# EAGLE design reference_nrf52840_module (EAGLE 9.3.0)
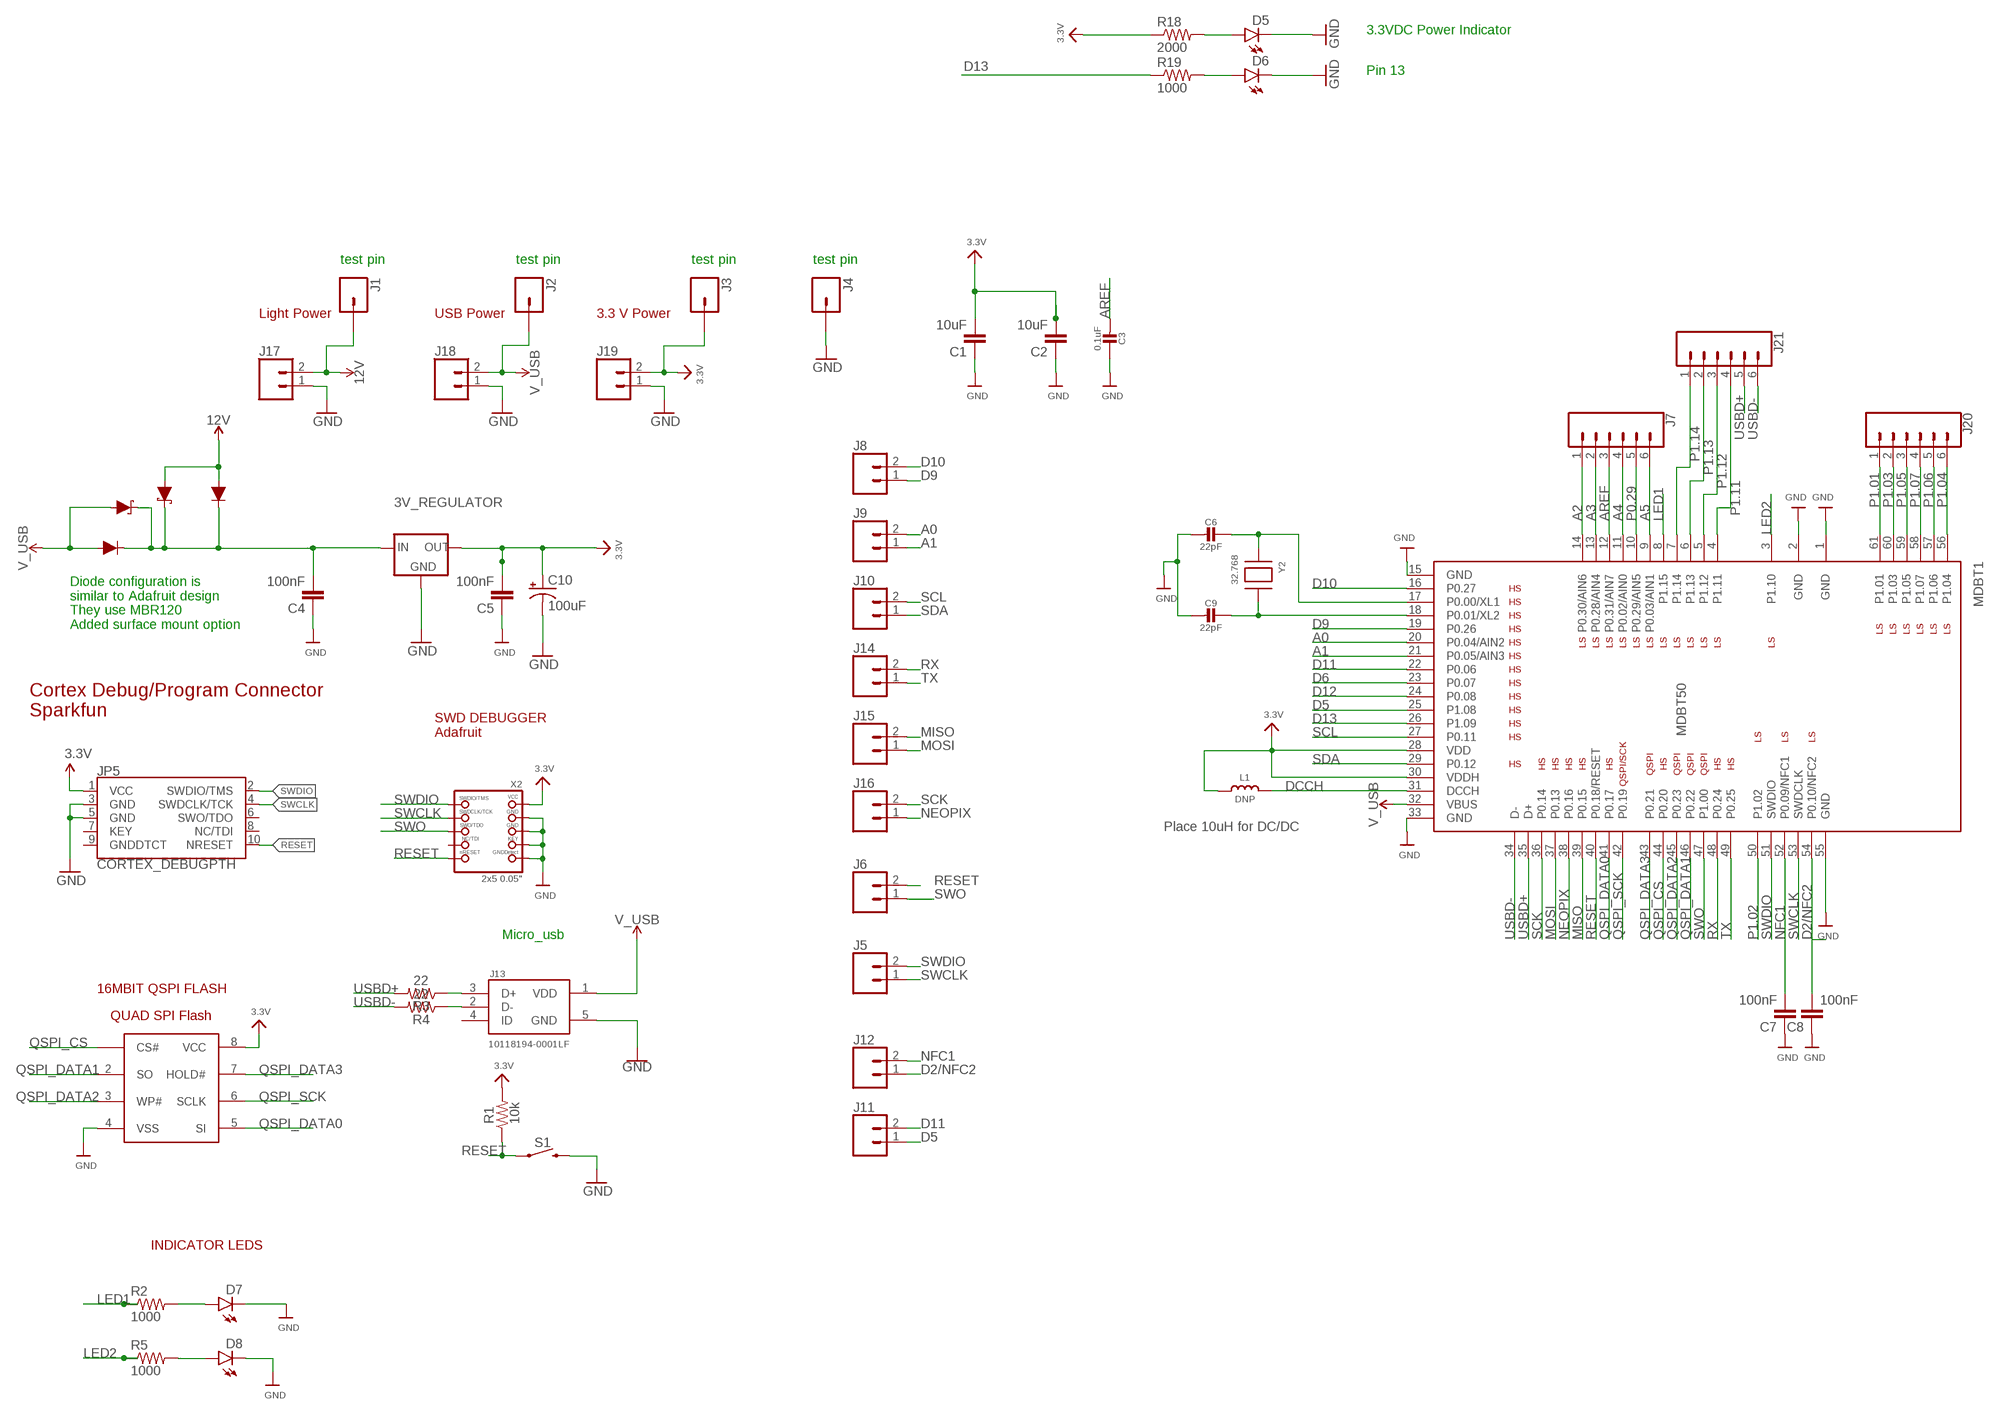
[diagram p0: schematic, sheet 1]

## Parts
3V_REGULATOR  LDL1117_5V_REG  [SOT223]
C1  10uF  10UF-0805-10V-10%  [0805]
C2  10uF  10UF-0805-10V-10%  [0805]
C3  0.1uF  CAP_CERAMIC_0805  [_0805]
C4  100nF  10UF-0805-10V-10%  [0805]
C5  100nF  10UF-0805-10V-10%  [0805]
C6  22pF  CAP_CERAMIC0603_NO  [0603-NO]
C7  100nF  10UF-0805-10V-10%  [0805]
C8  100nF  10UF-0805-10V-10%  [0805]
C9  22pF  CAP_CERAMIC0603_NO  [0603-NO]
C10  100uF  100UF-POLAR-RADIAL-2.5MM-25V-20%  [CPOL-RADIAL-2.5MM-6.5MM]
D1  1A/50V/1.1V  DIODE-PTH  [DIODE-1N4001]
D2  1A/50V/1.1V  DIODE-PTH  [DIODE-1N4001]
D3  3A/40V/500mV  DIODE-SCHOTTKY-B340A  [SMA-DIODE]
D4  3A/40V/500mV  DIODE-SCHOTTKY-B340A  [SMA-DIODE]
D5  LED1206  [LED-1206]
D6  LED1206  [LED-1206]
D7  LED1206  [LED-1206]
D8  LED1206  [LED-1206]
J1  M01PTH  [1X01]
J2  M01PTH  [1X01]
J3  M01PTH  [1X01]
J4  M01PTH  [1X01]
J5  CONN_025MM  [SCREWTERMINAL-5MM-2]
J6  CONN_025MM  [SCREWTERMINAL-5MM-2]
J7  CONN_06NO_SILK_FEMALE_PTH  [1X06_NO_SILK]
J8  CONN_025MM  [SCREWTERMINAL-5MM-2]
J9  CONN_025MM  [SCREWTERMINAL-5MM-2]
J10  CONN_025MM  [SCREWTERMINAL-5MM-2]
J11  CONN_025MM  [SCREWTERMINAL-5MM-2]
J12  CONN_025MM  [SCREWTERMINAL-5MM-2]
J13  10118194-0001LF  [FRAMATOME_10118194-0001LF]
J14  CONN_025MM  [SCREWTERMINAL-5MM-2]
J15  CONN_025MM  [SCREWTERMINAL-5MM-2]
J16  CONN_025MM  [SCREWTERMINAL-5MM-2]
J17  CONN_025MM  [SCREWTERMINAL-5MM-2]
J18  CONN_025MM  [SCREWTERMINAL-5MM-2]
J19  CONN_025MM  [SCREWTERMINAL-5MM-2]
J20  CONN_06NO_SILK_FEMALE_PTH  [1X06_NO_SILK]
J21  CONN_06NO_SILK_FEMALE_PTH  [1X06_NO_SILK]
JP5  CORTEX_DEBUGPTH  [2X5-PTH-1.27MM]
L1  DNP  INDUCTOR_0805MP  [_0805MP]
MDBT1  MDBT50  [MDBT50]
R1  10k  RESISTOR0805  [0805]
R2  1000  RESISTOR0805-RES  [0805]
R3  22  RESISTOR0805  [0805]
R4  22  RESISTOR0805  [0805]
R5  1000  RESISTOR0805-RES  [0805]
R18  2000  RESISTOR0805-RES  [0805]
R19  1000  RESISTOR0805-RES  [0805]
S1  MOMENTARY-SWITCH-SPST-PTH-6.0MM-KIT  [TACTILE_SWITCH_PTH_6.0MM_KIT]
U$4  QUAD_SPI_FLASH  [SO08]
X2  2x5 0.05"  JTAG-CORTEXBOXPOSTS  [2X05_1.27MM_BOX_POSTS]
Y2  32.768  XTAL-3.2X1.5  [XTAL3215]

## Nets
3.3V [power]: 3V_REGULATOR.2(OUT) 3V_REGULATOR.4(OUT) C1.2 C2.2 C5.2 C10.1(+) J3.1 J19.2 JP5.1(VCC) L1.1 MDBT1.28(VDD) MDBT1.30(VDDH) R1.2 R18.1 U$4.8(VCC) X2.1(VCC)
12V: D1.A D3.A J1.1 J17.2
A0: J9.2 MDBT1.20(P0.04/AIN2)
A1: J9.1 MDBT1.21(P0.05/AIN3)
A2: J7.1 MDBT1.14(P0.30/AIN6)
A3: J7.2 MDBT1.13(P0.28/AIN4)
A4: J7.4 MDBT1.11(P0.02/AIN0)
A5: J7.6 MDBT1.9(P0.03/AIN1)
AREF: C3.2 J7.3 MDBT1.12(P0.31/AIN7)
D2/NFC2: C8.2 J12.1 MDBT1.54(P0.10/NFC2)
D5: J11.1 MDBT1.25(P1.08)
D6: MDBT1.23(P0.07)
D9: J8.1 MDBT1.19(P0.26)
D10: J8.2 MDBT1.16(P0.27)
D11: J11.2 MDBT1.22(P0.06)
D12: MDBT1.24(P0.08)
D13: MDBT1.26(P1.09) R19.1
DCCH: L1.2 MDBT1.31(DCCH)
GND: 3V_REGULATOR.1(GND) C1.1 C2.1 C3.1 C4.1 C5.1 C6.2 C7.1 C8.1 C9.2 C10.2(-) D5.C D6.C D7.C D8.C J4.1 J13.5(GND) J17.1 J18.1 J19.1 JP5.3(GND) JP5.5(GND) MDBT1.1(GND) MDBT1.2(GND) MDBT1.15(GND) MDBT1.33(GND) MDBT1.55(GND) S1.3 U$4.4(VSS) X2.3(GND) X2.5(GND) X2.7(KEY) X2.9(GNDDETECT)
LED1: MDBT1.8(P1.15) R2.1
LED2: MDBT1.3(P1.10) R5.1
MISO: J15.2 MDBT1.39(P0.15)
MOSI: J15.1 MDBT1.37(P0.13)
N$1: D7.A R2.2
N$2: J13.3(D+) R3.1
N$3: J13.2(D-) R4.1
N$5: 3V_REGULATOR.3(IN) C4.2 D1.C D2.C D3.C D4.C
N$6: C9.1 MDBT1.18(P0.01/XL2) Y2.P$2
N$7: C6.1 MDBT1.17(P0.00/XL1) Y2.P$1
N$14: D8.A R5.2
N$30: D5.A R18.2
N$31: D6.A R19.2
NEOPIX: J16.1 MDBT1.38(P0.16)
NFC1: C7.2 J12.2 MDBT1.52(P0.09/NFC1)
P0.29: J7.5 MDBT1.10(P0.29/AIN5)
P1.01: J20.1 MDBT1.61(P1.01)
P1.02: MDBT1.50(P1.02)
P1.03: J20.2 MDBT1.60(P1.03)
P1.04: J20.6 MDBT1.56(P1.04)
P1.05: J20.3 MDBT1.59(P1.05)
P1.06: J20.5 MDBT1.57(P1.06)
P1.07: J20.4 MDBT1.58(P1.07)
P1.11: J21.4 MDBT1.4(P1.11)
P1.12: J21.3 MDBT1.5(P1.12)
P1.13: J21.2 MDBT1.6(P1.13)
P1.14: J21.1 MDBT1.7(P1.14)
QSPI_CS: MDBT1.44(P0.20) U$4.1(CS#)
QSPI_DATA0: MDBT1.41(P0.17) U$4.5(SI)
QSPI_DATA1: MDBT1.46(P0.22) U$4.2(SO)
QSPI_DATA2: MDBT1.45(P0.23) U$4.3(WP#)
QSPI_DATA3: MDBT1.43(P0.21) U$4.7(HOLD#)
QSPI_SCK: MDBT1.42(P0.19) U$4.6(SCLK)
RESET: J6.2 JP5.10(NRESET) MDBT1.40(P0.18/RESET) R1.1 S1.1 X2.10(NRESET)
RX: J14.2 MDBT1.48(P0.24)
SCK: J16.2 MDBT1.36(P0.14)
SCL: J10.2 MDBT1.27(P0.11)
SDA: J10.1 MDBT1.29(P0.12)
SWCLK: J5.1 JP5.4(SWDCLK/TCK) MDBT1.53(SWDCLK) X2.4(SWDCLK)
SWDIO: J5.2 JP5.2(SWDIO/TMS) MDBT1.51(SWDIO) X2.2(SWDIO)
SWO: J6.1 MDBT1.47(P1.00) X2.6(SWO)
TX: J14.1 MDBT1.49(P0.25)
USBD+: J21.5 MDBT1.35(D+) R3.2
USBD-: J21.6 MDBT1.34(D-) R4.2
V_USB: D2.A D4.A J2.1 J13.1(VDD) J18.2 MDBT1.32(VBUS)
Unconnected: J13.4(ID) JP5.6(SWO/TDO) JP5.7(KEY) JP5.8(NC/TDI) JP5.9(GNDDTCT) X2.8(TDI)

## Notes on the sheet
- 3.3VDC Power Indicator
- Pin 13
- test pin | test pin | test pin | test pin
- Light Power | USB Power | 3.3 V Power
- Diode configuration is
  similar to Adafruit design
  They use MBR120
  Added surface mount option
- Cortex Debug/Program Connector
  Sparkfun
- SWD DEBUGGER
  Adafruit
- Place 10uH for DC/DC
- Micro_usb
- 16MBIT QSPI FLASH
- INDICATOR LEDS

## Library data of the parts
3V_REGULATOR = th_libraries_2:LDL1117_5V_REG: STMicroelectronics LDL1117S50R https://www.mouser.com/datasheet/2/389/ldl1117-1156241.pdf Mouser#: 511-LDL1117S50R bought 100 for $18 on ~2/3/18 5V, 1.2amp
C1 C2 = SparkFun-Capacitors:10UF: 10.0µF ceramic capacitors A capacitor is a passive two-terminal electrical component used to store electrical energy temporarily in an electric field.; PROD_ID: CAP-11330
C3 C6 C9 = microbuilder:CAP_CERAMIC: Ceramic Capacitors For new designs, use the packages preceded by an '_' character since they are more reliable: The following footprints should be used on most boards: _0402 - Standard footprint for regular board layouts _0603 - Standard footprint for regular board layouts _0805 - Standard footprint for regular board layouts _1206 - Standard footprint for regular board layouts For extremely tight-pitch boards where space is at a premium, the following 'micro-pitch' footprints can be used (smaller pads, no silkscreen outline, etc.): _0402MP - Micro-pitch footprint for very dense/compact boards _0603MP - Micro-pitch footprint for very dense/compact boards _0805MP - Micro-pitch footprint for very dense/compact boards _1206MP - Micro-pitch footprint for very dense/compact boards
C4 C5 C7 C8 = SparkFun-Capacitors:10UF: 10.0µF ceramic capacitors A capacitor is a passive two-terminal electrical component used to store electrical energy temporarily in an electric field.; PROD_ID: CAP-11330; VALUE: 10uF
C10 = SparkFun-Capacitors:100UF-POLAR: 100µF polarized capacitors A capacitor is a passive two-terminal electrical component used to store electrical energy temporarily in an electric field.; PROD_ID: CAP-08439
D1 D2 = SparkFun-DiscreteSemi:DIODE: Diode These are standard reverse protection diodes and small signal diodes. SparkFun Products: SparkFun SparkPunk Sound Kit <https://www.sparkfun.com/products/11177> SparkFun ESP8266 Thing <https://www.sparkfun.com/products/13231>; PROD_ID: DIO-09176
D3 D4 = SparkFun-DiscreteSemi:DIODE-SCHOTTKY: Schottky diode A Schottky diode is a semiconductor diode which has a low forward voltage drop and a very fast switching action.; PROD_ID: DIO-09886
D5-D8 = SparkFun-LED:LED: LEDs Standard schematic elements and footprints for 5mm, 3mm, 1206, and 0603 sized LEDs. 5mm - Spark Fun Electronics SKU : COM-00529 (and others)
J1-J4 = SparkFun-Connectors:M01: Header 1 Standard 1-pin 0.1" header. Use with straight break away headers (SKU : PRT-00116), right angle break away headers (PRT-00553), swiss pins (PRT-00743), machine pins (PRT-00117), and female headers (PRT-00115). SMTSO-256-ET is a "flush mount" nut for a 4-40 screw. The older package used to be too tight, and did not allow it to sit properly thru the drill hit. The latest (0.165DIA) fits nice and snug.
J5 J6 J8-J12 J14-J19 = SparkFun-Connectors:CONN_02: Multi connection point. Often used as Generic Header-pin footprint for 0.1 inch spaced/style header connections On any of the 0.1 inch spaced packages, you can populate with these: Break Away Headers - Straight <https://www.sparkfun.com/products/116> (PRT-00116) Break Away Male Headers - Right Angle <https://www.sparkfun.com/products/553> (PRT-00553) Female Headers <https://www.sparkfun.com/products/115> (PRT-00115) Break Away Headers - Machine Pin <https://www.sparkfun.com/products/117> (PRT-00117) Break Away Female Headers - Swiss Machine Pin <https://www.sparkfun.com/products/743> (PRT-00743) For SCREWTERMINALS and SPRING TERMINALS visit here: Screw Terimnals on SparkFun.com <https://www.sparkfun.com/search/results?term=Screw+Terminals> (5mm/3.5mm/2.54mm spacing) This device is also useful as a general connection point to wire up your design to another part of your project. Our various solder wires solder well into these plated through hole pads. Hook-Up Wire - Assortment (Stranded, 22 AWG) <https://www.sparkfun.com/products/11375> (PRT-11375) Hook-Up Wire - Assortment (Solid Core, 22 AWG) <https://www.sparkfun.com/products/11367> (PRT-11367) View the entire wire category on our website here <https://www.sparkfun.com/categories/141> Special notes: Molex polarized connector foot print use with: PRT-08233 with associated crimp pins and housings. 2.54_SCREWTERM for use with PRT-10571. 3.5mm Screw Terminal footprints for PRT-08084 5mm Screw Terminal footprints for use with PRT-08432; SF_SKU: PRT-08432
J7 J20 J21 = SparkFun-Connectors:CONN_06: Multi connection point. Often used as Generic Header-pin footprint for 0.1 inch spaced/style header connections On any of the 0.1 inch spaced packages, you can populate with these: Break Away Headers - Straight <https://www.sparkfun.com/products/116> (PRT-00116) Break Away Male Headers - Right Angle <https://www.sparkfun.com/products/553> (PRT-00553) Female Headers <https://www.sparkfun.com/products/115> (PRT-00115) Break Away Headers - Machine Pin <https://www.sparkfun.com/products/117> (PRT-00117) Break Away Female Headers - Swiss Machine Pin <https://www.sparkfun.com/products/743> (PRT-00743) Arduino Stackable Header - 6 Pin <https://www.sparkfun.com/products/9280> (PRT-09280) For SCREWTERMINALS and SPRING TERMINALS visit here: Screw Terimnals on SparkFun.com <https://www.sparkfun.com/search/results?term=Screw+Terminals> (5mm/3.5mm/2.54mm spacing) This device is also useful as a general connection point to wire up your design to another part of your project. Our various solder wires solder well into these plated through hole pads. Hook-Up Wire - Assortment (Stranded, 22 AWG) <https://www.sparkfun.com/products/11375> (PRT-11375) Hook-Up Wire - Assortment (Solid Core, 22 AWG) <https://www.sparkfun.com/products/11367> (PRT-11367) View the entire wire category on our website here <https://www.sparkfun.com/categories/141>; PROD_ID: CONN-08437
J13 = 10118194-0001LF:10118194-0001LF: Conn Micro USB Type B RCP 5 POS 0.65mm Solder RA SMD 5 Terminal 1 Port T/R; AVAILABILITY: Unavailable; DESCRIPTION: Micro Usb, 2.0 Type b, Rcpt, Smt; MF: Amphenol ICC; MP: 10118194-0001LF; PACKAGE: None; PRICE: None
JP5 = samd21-temp:CORTEX_DEBUG: Cortex Debug Connector Datasheet <http://infocenter.arm.com/help/topic/com.arm.doc.faqs/attached/13634/cortex_debug_connectors.pdf>
L1 = microbuilder:INDUCTOR: Inductors 0603: 10nH Ceramic Inductor - microwire antenna/RF (Digikey: 712-1434-2-ND) 0805: 560nH Ceramic Inductor - RF (Digikey: 553-1047-1-ND) 270nH Ceramic Inductor - Q = 40@250MHz, +-5%, 1 Ohm DC Resistance (Digikey: 535-10506-2-ND) 1007 (2518 Metric) SMT: 10µH 10% 250mOhm 820mA 1007 Inductor (Digikey: 587-2189-1-ND) 22µH 10% 500mOhm 580mA 1007 Inductor (Digikey: 587-2190-1-ND) 47µH 10% 950mOhm 420mA 1007 Inductor (Digikey: 587-2191-1-ND) 47µH 5% 100mOhm 1A 1008 Inductor (Digikey: 732-1816-1-ND) 5.0x5.0mm (Taiyo Yuden NR5040 Series) 6.8µH 20% 2.3A 64mOhm Inductor (Digikey: 587-2374-2-ND) 5.0x5.0mm (TDK VLC5045 Series) 4.7µH 20% 3.3A 34mOhm Inductor (Digikey: 445-6526-1-ND) 6.8µH 20% 2.7A 46mOhm Inductor (Digikey: 445-6527-1-ND) 6.0x6.0mm (TDK VLC6045 Series) 4.7µH 20% 3.8A 27mOhm Inductor (Digikey: 445-6538-2-ND) 6.8µH 20% 3A 41mOhm Inductor (Digikey: 445-6540-1-ND) 6.2µH 30% 2.2A 45mOhm Inductor (Digikey: SRR5028-6R2YCT-ND) - Not TDK VLC6045 but footprint should match 6.0x6.0mm (TDK SLF6045 Series) 6.8uH 30% 2A 33mOhm Inductor (Digikey: 445-4572-1-ND, Mouser: 810-SLF645T6R8N2R0PF) 6.0x6.0mm (Sumida CDRH5D28 Series) 6.2uH 30% 1.8A 45mOhm Inductor (Digikey: 308-1542-1-ND) Taiyo Yuden NR3015T2R2M - 2.2uH 20% 1.5A (Digikey: 587-1648-2-ND, Mouser: 963-NR3015T2R2M) - Used with TI TPS62172 CoilCraft RFID Transponder Coil - MA5532-AE (For use with AS3935 Lightning Sensor) Taiyo Yuden NRH2412T2R2MNGH - 2.2uH 20% 1AA (Digikey: 587-3443-1-ND) - Used with TI LM3671 Vishay IHLP 1.0uH Molded Inductor - 24mOhm DCR, 5A, +/-20%, -55°C-125°C (Digikey: 541-1319-1-ND)
MDBT1 = microbuilder:MDBT50: Raytac Corporation MDBT50 Bluetooth Low Energy Module based on Noridc nRF52840 Source: Raytac datasheet
R1 R3 R4 = SparkFun-Resistors:RESISTOR: Generic Resistor Package
R2 R5 R18 R19 = SparkFun-Passives:RESISTOR: Resistor Basic schematic elements and footprints for 0603, 1206, and PTH resistors.
S1 = SparkFun-Switches:MOMENTARY-SWITCH-SPST: Momentary Switch (Pushbutton) - SPST Normally-open (NO) SPST momentary switches (buttons, pushbuttons). Variants PTH-12MM - 12mm square, through-hole Momentary Pushbutton Switch - 12mm Square <https://www.sparkfun.com/products/9190> (COM-09190) PTH-6.0MM, PTH-6.0MM-KIT - 6.0mm square, through-hole Mini Pushbutton Switch <https://www.sparkfun.com/products/97> (COM-00097) KIT package intended for soldering kit's - only one side of pads' copper is exposed. PTH-RIGHT-ANGLE-KIT - Right-angle, through-hole Right Angle Tactile Button <https://www.sparkfun.com/products/10791> - Used on SparkFun BigTime Watch Kit <https://www.sparkfun.com/products/11734> SMD-12MM - 12mm square, surface-mount Tactile Button - SMD (12mm) <https://www.sparkfun.com/products/12993> (COM-12993) Used on SparkFun PicoBoard <https://www.sparkfun.com/products/11888> SMD-4.5MM - 4.5mm Square Trackball Switch Used on SparkFun Blackberry Trackballer Breakout <https://www.sparkfun.com/products/13169> SMD-4.6MMX2.8MM - 4.60mm x 2.80mm, surface mount Used on SparkFun SAMD21 Mini Breakout <https://www.sparkfun.com/products/13664> SMD-5.2MM, SMD-5.2-REDUNDANT - 5.2mm square, surface-mount Mini Pushbutton Switch - SMD <https://www.sparkfun.com/products/8720> (COM-08720) Used on Arduino Pro Mini <https://www.sparkfun.com/products/11114> REDUNDANT package connects both switch circuits together SMD-6.0X3.5MM - 6.0 x 3.5mm, surface mount Momentary Reset Switch SMD <https://www.sparkfun.com/products/8229> (COM-08229) SMD-6.2MM-TALL - 6.2mm square, surface mount Tactile Button - SMD (6mm) <https://www.sparkfun.com/products/12992> Used on SparkFun Digital Sandbox <https://www.sparkfun.com/products/12651> SMD-RIGHT-ANGLE - Right-angle, surface mount Used on SparkFun Block for Intel® Edison - Arduino <https://www.sparkfun.com/products/13036>; PROD_ID: SWCH-08441; SF_SKU: COM-00097
U$4 = th_libraries_2:QUAD_SPI_FLASH: https://www.digikey.com/product-detail/en/gigadevice-semiconductor-hk-limited/GD25Q32CSJGR/1970-1032-1-ND/9484782 16 and 32Mbit flash for circuit python
X2 = microbuilder:JTAG-CORTEX: Serial Wire (SW-DP) Connector Standard 0.05" 10-pin connector is for use with the Cortex M and Cortex A SWD (serial wire debugger) interface (SW-DP) Connectors 2x05_1.27MM_SMT - Inexpensive surface-mount header with bare pins, compatible with standard 10-pin SWD cables (4UCON: 16846) 2x05_1.27MM_BOX_NOPOSTS - Polarised surface-mount box (4UCON with caps: 19735, without caps: 15117 2x05_1.27MM_BOX_POSTS - Polarised surface-mount box with mounting holes (4UCON: 20317) Pinout: http://infocenter.arm.com/help/topic/com.arm.doc.faqs/attached/13634/cortex_debug_connectors.pdf http://www.keil.com/peripherals/coresight/connectors.asp
Y2 = adafruit2:XTAL: Low cost SMT crystals, no capacitors included http://www.ladyada.net/library/eagle

## Net classes
1 power: width 0.254 mm

## Board
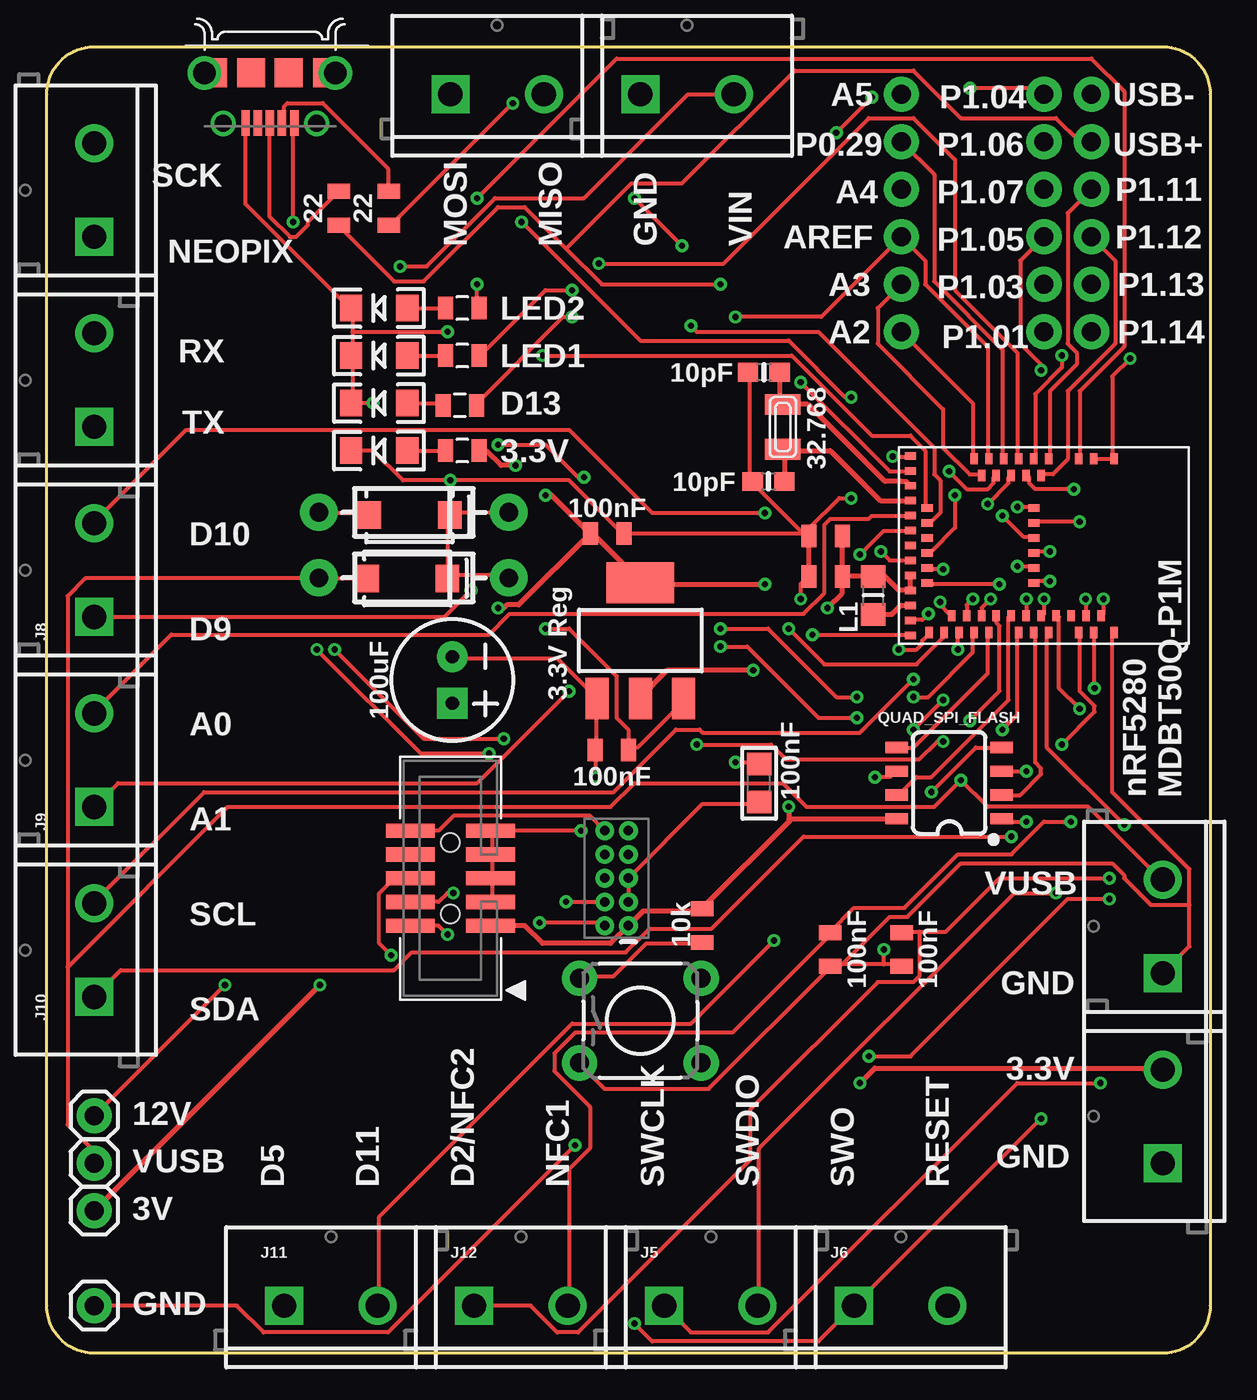
[diagram p1: board, top side]
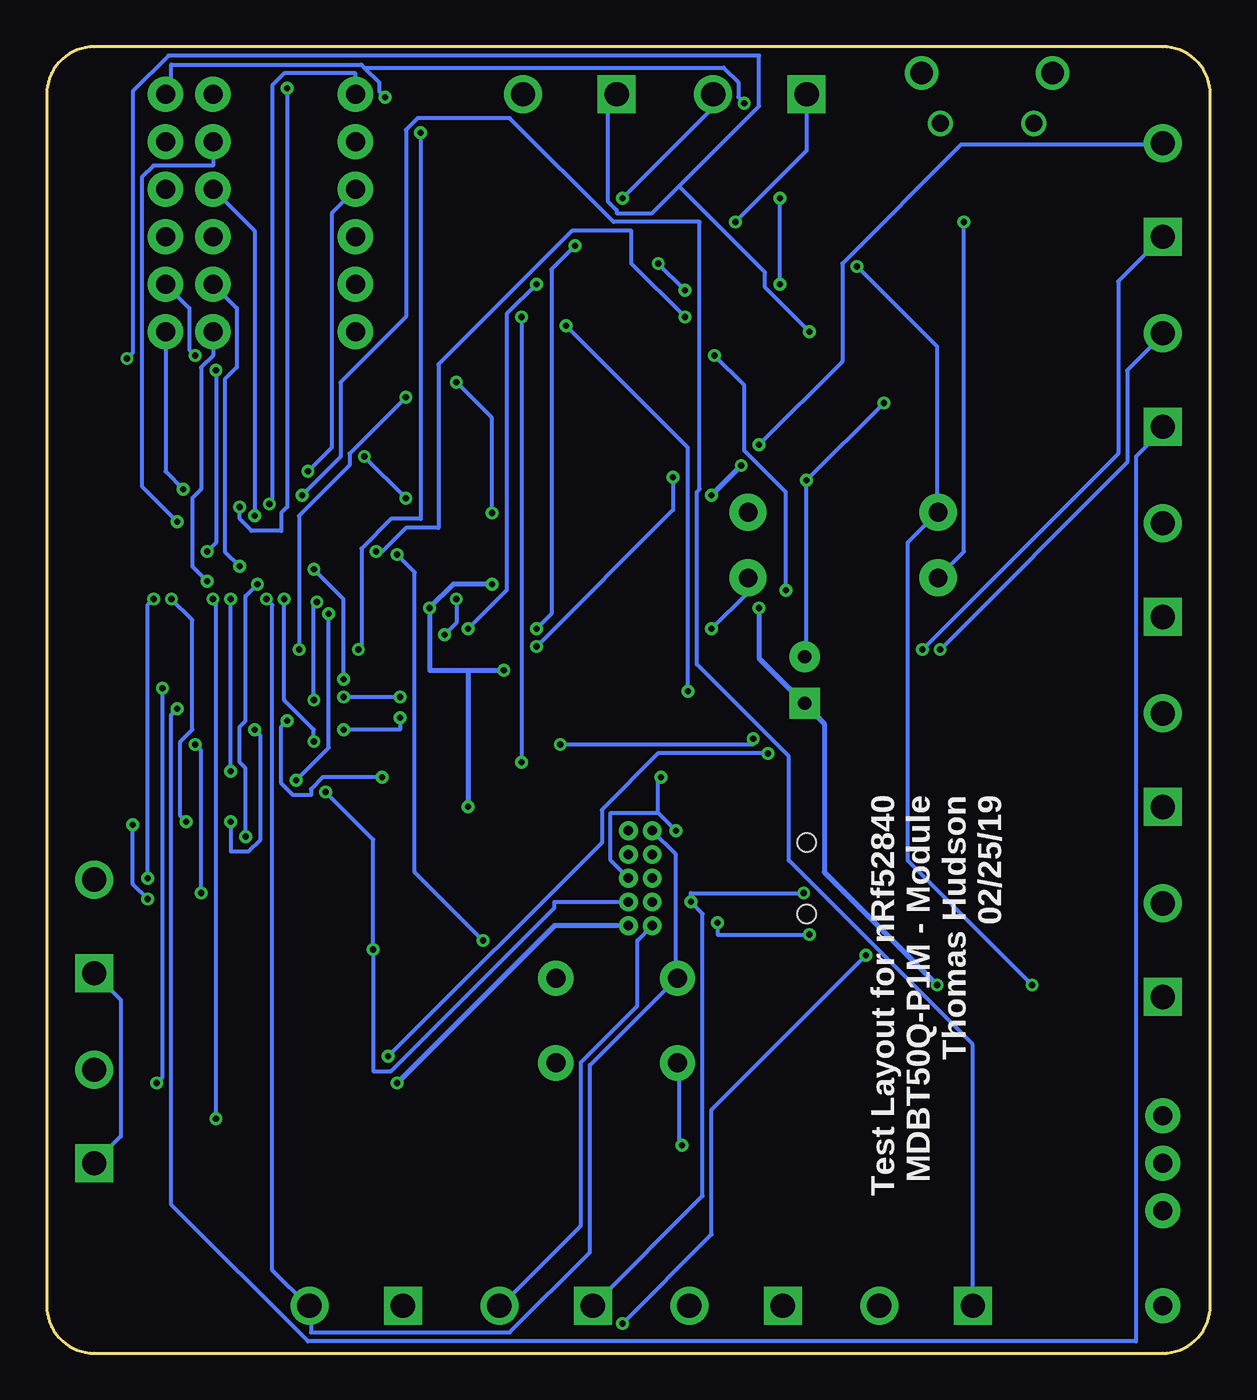
[diagram p2: board, bottom side, seen from below]

Size 62.23 x 69.85 mm. Coordinates in mm from the lower left corner, seen from the top.
Outline: 2.54,0 arc-90 0,2.54 0,67.31 arc-90 2.54,69.85 59.69,69.85 arc-90 62.23,67.31 62.23,2.54 arc-90 59.69,0 2.54,0
Copper layers (1*16): Top 0.0356mm / dielectric 1.5011mm / Bottom 0.0356mm
Design rules "LaenPCBOrder *": minimum track width 8mil, minimum drill 13mil, track to track 8mil, track to pad 8mil, pad to pad 8mil, via to via 8mil, smd to smd 8mil, copper to edge 10mil, drill to drill 8mil, minimum pad ring 7mil, minimum via ring 7mil, stop-mask expansion 3mil, vias tented up to drill 25mil, thermal gap 10mil
tRestrict: area 57.5,30.5 to 62.2,53.3
bRestrict: area 57.2,30.5 to 62.2,52.1

### Footprints (pad centres in the part's own frame; a part is rotated, then mirrored left to right if it is on the bottom)
SOT223 = smd 1.219 x 2.235: 1 -2.311,-3.099; 2 0,-3.099; 3 2.311,-3.099 | smd 3.6 x 2.2: 4 0,3.099
0805 = smd 0.8 x 1.2: 1 -0.9,0; 2 0.9,0
_0805 = smd 1.2 x 1.3: 1 -1.016,0; 2 1.016,0
0603-NO = smd 1.075 x 1: 1 -0.85,0; 2 0.85,0
CPOL-RADIAL-2.5MM-6.5MM = drill 0.7 pad 1.651 square: 1 1.25,0 | drill 0.7 pad 1.651: 2 -1.25,0
DIODE-1N4001 = drill 1 pad 1.981: A -5.08,0; C 5.08,0
SMA-DIODE = smd 1.27 x 1.47: A -2.15,0; C 2.15,0
LED-1206 = smd 1.2 x 1.4: A -1.5,0; C 1.5,0
1X01 = drill 1.016 pad 1.88: 1 0,0
SCREWTERMINAL-5MM-2 = drill 1.3 pad 2.032 square: 1 0,0 | drill 1.3 pad 2.032: 2 5,0
1X06_NO_SILK = drill 1.016 pad 1.88: 1 0,0; 2 2.54,0; 3 5.08,0; 4 7.62,0; 5 10.16,0; 6 12.7,0
FRAMATOME_10118194-0001LF = smd 0.45 x 1.35: 1 -1.3,2.675; 2 -0.65,2.675; 3 0,2.675; 4 0.65,2.675; 5 1.3,2.675 | drill 0.9: P$6 -2.5,2.7; P$7 2.5,2.7 | drill 1.2: P$8 -3.5,0; P$9 3.5,0 | smd 1.5 x 1.55: P$10 -1,0; P$11 1,0; P$12 -3.05,0; P$13 3.05,0
2X5-PTH-1.27MM = drill 0.508 pad 1: 1 -2.54,-0.635; 2 -2.54,0.635; 3 -1.27,-0.635; 4 -1.27,0.635; 5 0,-0.635; 6 0,0.635; 7 1.27,-0.635; 8 1.27,0.635; 9 2.54,-0.635; 10 2.54,0.635
_0805MP = smd 1.2 x 1.3: 1 -1.016,0; 2 1.016,0
MDBT50 = smd 0.6 x 0.4: 1 -4.65,3.75; 2 -4.65,2.65; 3 -4.65,1.85; 4 -4.65,0.25; 5 -3.75,-0.15; 6 -4.65,-0.55; 7 -3.75,-0.95; 8 -4.65,-1.35; 9 -3.75,-1.75; 10 -4.65,-2.15; 11 -3.75,-2.55; 12 -4.65,-2.95; 13 -3.75,-3.35; 14 -4.65,-3.75; 34 4.65,-6.15; 35 4.65,-5.35; 36 3.75,-4.95; 37 4.65,-4.55; 38 3.75,-4.15; 39 4.65,-3.75; 40 3.75,-3.35; 41 4.65,-2.95; 42 3.75,-2.55; 43 3.75,-1.75; 44 4.65,-1.35; 45 3.75,-0.95; 46 4.65,-0.55; 47 3.75,-0.15; 48 4.65,0.25; 49 3.75,0.65; 50 3.75,1.45; 51 4.65,1.85; 52 3.75,2.25; 53 4.65,2.65; 54 3.75,3.05; 55 4.65,3.75 | smd 0.4 x 0.6: 15 -4.8,-7.15; 16 -4,-7.15; 17 -3.2,-7.15; 18 -2.4,-7.15; 19 -2,-6.25; 20 -1.6,-7.15; 21 -1.2,-6.25; 22 -0.8,-7.15; 23 -0.4,-6.25; 24 0,-7.15; 25 0.4,-6.25; 26 0.8,-7.15; 27 1.2,-6.25; 28 1.6,-7.15; 29 2,-6.25; 30 2.4,-7.15; 31 3.2,-7.15; 32 4,-7.15; 33 4.8,-7.15; 56 -2,-0.55; 57 -1.2,-0.55; 58 -0.4,-0.55; 59 0.4,-0.55; 60 1.2,-0.55; 61 2,-0.55
TACTILE_SWITCH_PTH_6.0MM_KIT = drill 1.016 pad 1.88: 1 -3.251,2.261; 2 3.251,2.261; 3 -3.251,-2.261; 4 3.251,-2.261
SO08 = smd 0.6 x 1.2: 1 -1.905,-2.8; 2 -0.635,-2.8; 3 0.635,-2.8; 4 1.905,-2.8; 5 1.905,2.8; 6 0.635,2.8; 7 -0.635,2.8; 8 -1.905,2.8
2X05_1.27MM_BOX_POSTS = smd 0.76 x 2.6: 1 -2.54,-2.15; 2 -2.54,2.15; 3 -1.27,-2.15; 4 -1.27,2.15; 5 0,-2.15; 6 0,2.15; 7 1.27,-2.15; 8 1.27,2.15; 9 2.54,-2.15; 10 2.54,2.15 | hole 1: -1.905,0; 1.905,0
XTAL3215 = smd 1.1 x 1.9: P$1 1.2,0; P$2 -1.2,0

### Placement (x,y rotation side)
3V_REGULATOR  31.75,38.1 0 top
C1  41.66,41.53 0 top
C2  41.66,43.69 0 top
C3  38.1,30.48 90 top
C4  30.23,32.26 0 top
C5  29.97,43.82 180 top
C6  38.35,52.45 180 top
C7  41.91,21.59 90 top
C8  45.72,21.59 90 top
C9  38.61,46.61 180 top
C10  21.69,35.99 270 top
D1  19.63,44.96 0 top
D2  19.63,41.45 0 top
D3  19.41,44.81 0 top
D4  19.28,41.43 0 top
D5  17.78,48.26 180 top
D6  17.78,50.8 180 top
D7  17.78,53.34 180 top
D8  17.78,55.88 180 top
J1  2.54,12.7 0 top
J2  2.54,10.16 0 top
J3  2.54,7.62 0 top
J4  2.54,2.54 0 top
J5  33.02,2.54 0 top
J6  43.18,2.54 0 top
J7  45.72,54.61 90 top
J8  2.54,39.37 90 top
J9  2.54,29.21 90 top
J10  2.54,19.05 90 top
J11  12.7,2.54 0 top
J12  22.86,2.54 0 top
J13  11.94,68.45 180 top
J14  2.54,49.53 90 top
J15  21.59,67.31 0 top
J16  2.54,59.69 90 top
J17  31.75,67.31 0 top
J18  59.69,20.32 90 top
J19  59.69,10.16 90 top
J20  53.34,54.61 90 top
J21  55.88,54.61 90 top
JP5  30.48,25.4 90 top
L1  44.2,40.51 270 top
MDBT1  53.34,43.18 270 top
R1  35.05,22.86 90 top
R2  22.22,53.34 180 top
R3  15.62,61.21 270 top
R4  18.29,61.21 270 top
R5  22.22,55.88 180 top
R18  22.22,48.26 180 top
R19  22.1,50.67 180 top
S1  31.75,17.78 0 top
U$4  48.26,30.48 90 top
X2  21.59,25.4 90 top
Y2  39.37,49.53 90 top

### Tracks (layer width: path | path; a pad name or v marks a point on that pad's centre or on a via)
3.3V  (via drill 0.33)
  Top 0.254: C1.2 L1.1 44.83,41.53 45.58,40.78 MDBT1.30 46.2,40.8 46.2,41.43 MDBT1.28 | C1.2 C2.2 | U$4.8 39.85,28.57 39.77,28.5 | 39.77,28.5 35.08,23.81 R1.2 34.92,23.65 31.91,23.65 JP5.1 30.16,21.91 26.51,21.91 25.56,22.86 X2.1 | v43.5,14.45 44.29,15.24 59.69,15.24 J19.2 | v41.75,39.85 42.54,40.64 42.54,41.43 C1.2 | v38.42,41.12 31.75,41.12 3V_REGULATOR.4 31.75,41.28 29.21,43.82 C5.2 29.05,43.82 | R18.1 23.5,48.26 24.29,47.47 v25.08,47.47 | v26.67,45.88 26.99,45.88 29.05,43.82 | v37.78,36.51 33.18,36.51 31.75,35.08 3V_REGULATOR.2 | v24.13,39.85 24.45,39.85 24.61,40.01 25.24,40.01 29.05,43.82 | v14.6,19.68 J3.1 | v39.69,29.21 39.69,28.57 39.77,28.5
  Bottom 0.254: v43.5,14.45 35.08,22.86 JP5.1 | v38.42,41.12 40.48,41.12 v41.75,39.85 41.75,36.51 39.69,36.51 | v26.67,45.88 v25.08,47.47 | 39.69,36.51 v37.78,36.51 | v24.13,39.85 24.13,37.15 21.75,34.77 C10.1 21.59,34.61 20.64,33.66 20.64,25.72 v14.6,19.68 | 39.69,36.51 v39.69,29.21
12V  (via drill 0.33)
  Top 0.203: D3.A 17.14,44.93 14.6,44.93 D1.A | v9.52,19.68 J1.1 | J17.2 34.29,67.31 28.73,61.75 23.97,61.75 20.32,58.1 v18.89,58.1
  Bottom 0.203: v9.52,19.68 16.19,26.35 16.19,43.34 14.6,44.93 D1.A 14.6,45.09 14.6,53.82 v18.89,58.1
A0
  Top 0.203: MDBT1.20 46.04,44.77 44.13,44.77 43.97,44.61 41.91,44.61 41.59,44.29 41.59,40.64 40.48,39.53 24.76,39.53 23.65,38.42 6.67,38.42 2.54,34.29 J9.2
A1  (via drill 0.33)
  Top 0.203: v34.45,54.93 34.77,54.61 41.28,54.61 47.47,48.42 47.47,46.99 47.78,46.67 47.78,44.93 47.31,44.45 47.15,44.45 MDBT1.21 | v27.94,35.4 23.02,30.48 3.81,30.48 J9.1
  Bottom 0.203: v34.45,54.93 27.94,48.42 v27.94,35.4
A2
  Top 0.203: J7.1 49.53,50.8 49.53,47.94 MDBT1.14
A3
  Top 0.203: J7.2 44.45,55.88 44.45,53.98 47.94,50.48 47.94,48.42 49.37,46.99 49.85,46.99 MDBT1.13
A4  (via drill 0.33)
  Top 0.203: v48.26,47.15 49.21,46.2 50.32,46.2 50.64,46.51 50.64,46.83 MDBT1.11
  Bottom 0.203: v48.26,47.15 46.99,48.42 46.99,60.96 J7.4
A5  (via drill 0.33)
  Top 0.203: v50.32,45.4 51.44,46.51 51.44,46.83 MDBT1.9
  Bottom 0.203: v50.32,45.4 50.16,45.56 50.16,67.79 49.53,68.42 45.72,68.42 J7.6
AREF  (via drill 0.33)
  Top 0.203: MDBT1.12 50.32,47.94 50.32,53.82 46.99,57.15 46.99,58.42 J7.3 41.43,55.4 v36.83,55.4 | v36.83,31.59 38.1,31.59 C3.2
  Bottom 0.203: v36.83,55.4 v36.83,31.59
D2/NFC2  (via drill 0.33)
  Top 0.203: v56.51,40.32 56.51,39.53 MDBT1.54 | v56.83,25.4 50.96,25.4 48.1,22.54 46.67,22.54 | 46.67,22.54 45.72,22.54 C8.2 | J12.1 25.88,2.54 27.31,1.11 28.42,1.11 37.62,10.32 37.62,13.02 44.45,19.84 46.35,19.84 46.67,20.16 46.67,22.54
  Bottom 0.203: v56.51,40.32 56.83,40.01 v56.83,25.4
D5  (via drill 0.33)
  Top 0.203: v48.58,45.88 48.58,44.13 47.31,42.86 47.15,42.86 MDBT1.25
  Bottom 0.203: v48.58,45.88 46.51,47.94 46.51,51.91 43.02,55.4 43.02,65.41 42.39,66.04 37.47,66.04 31.91,60.48 27.31,60.48 27.31,46.2 27.46,46.04 27.46,36.83 22.54,31.91 22.54,26.35 12.7,16.51 J11.1
D9  (via drill 0.33)
  Top 0.203: v26.51,53.34 39.85,53.34 44.13,49.05 46.2,49.05 46.99,48.26 46.99,45.24 MDBT1.19 | v22.7,40.8 21.27,39.37 J8.1
  Bottom 0.203: v26.51,53.34 24.92,51.75 24.92,48.26 22.7,46.04 v22.7,40.8
D10  (via drill 0.33)
  Top 0.203: v40.32,51.91 45.08,47.15 46.04,47.15 MDBT1.16 | v38.42,44.93 32.38,44.93 27.94,49.37 7.46,49.37 2.54,44.45 J8.2
  Bottom 0.203: v40.32,51.91 38.42,50.01 v38.42,44.93
D11  (via drill 0.33)
  Top 0.203: v43.5,42.7 44.77,43.97 46.04,43.97 MDBT1.22 | v38.89,22.07 34.45,17.62 28.1,17.62 17.78,7.3 17.78,2.54 J11.2
  Bottom 0.203: v43.5,42.7 42.54,41.75 42.54,25.72 v38.89,22.07
D13  (via drill 0.33)
  Top 0.203: v44.61,42.86 45.08,42.39 46.04,42.39 MDBT1.26 | v28.1,55.4 27.62,55.4 23.02,50.8 R19.1
  Bottom 0.203: v44.61,42.86 44.29,42.86 43.02,44.13 41.28,44.13 41.28,52.86 34.13,60.01 30.96,60.01 30.96,58.26 v28.1,55.4
DCCH
  Top 0.254: L1.2 45.21,39.5 45.69,39.98 MDBT1.31
GND  (via drill 0.33)
  Top 0.203: MDBT1.2 56.04,47.78 56.99,47.78 MDBT1.1 56.99,47.94 56.99,52.23 v57.94,53.18 | C6.2 37.62,52.39 37.62,46.67 C9.2 37.78,46.51 40.48,43.82 | v40.96,38.42 46.04,38.42 MDBT1.33 | v40.32,40.32 40.32,41.12 40.64,41.43 C1.1 | v45.24,47.94 46.04,47.94 MDBT1.15 | v43.02,45.72 42.39,45.72 40.8,44.13 40.8,43.82 C2.1 | 40.48,43.82 40.64,43.82 C2.1 | 40.48,43.82 C5.1 30.8,43.82 27.94,46.67 v21.59,46.67 19.05,46.67 17.46,48.26 D5.C | 40.48,43.82 C2.1 | 16.35,53.34 16.35,50.8 | J13.5 10.64,65.72 10.64,61.44 16.19,55.88 D8.C 16.35,55.88 16.35,54.61 | 16.35,54.61 16.35,53.34 | 16.35,53.34 D7.C | C10.2 21.75,37.15 27.31,37.15 29.37,35.08 3V_REGULATOR.1 29.37,34.92 29.37,32.38 C4.1 29.37,32.23 v29.37,30.8 | 23.81,25.4 23.81,24.13 X2.3 | 23.81,27.94 23.81,26.67 | 23.81,26.67 23.81,25.4 | 23.81,25.4 X2.5 | 23.81,26.67 X2.7 | C3.1 38.1,29.37 35.08,29.37 JP5.5 JP5.3 | v28.57,27.94 23.81,27.94 | 23.81,27.94 X2.9 | v17.46,50.8 16.35,50.8 | 16.35,50.8 D6.C | 16.35,54.61 v21.43,54.61 | 61.12,23.97 61.12,21.75 J18.1 | 61.12,23.97 61.12,25.88 56.99,30 56.99,38.42 MDBT1.55 | 44.77,20.8 45.72,20.8 C8.1 | 44.77,20.8 42.54,20.8 | 42.54,20.8 41.91,20.8 C7.1 41.91,20.64 35.4,14.13 29.84,14.13 28.57,15.4 S1.3 | U$4.4 49.69,32.38 v47.31,30 | 44.77,20.8 v44.77,21.59 | J4.1 10.16,2.54 11.59,1.11 18.26,1.11 v28.26,11.11 | 61.12,23.97 59.06,23.97 57.63,25.4 57.63,25.56 56.99,26.19 48.89,26.19 46.04,23.34 45.08,23.34 42.54,20.8
  Top 0.254: C1.1 C2.1
  Bottom 0.203: v57.94,53.18 57.63,53.5 57.63,67.47 55.72,69.37 24.13,69.37 24.13,66.67 28.42,62.39 | 28.42,62.39 29.84,60.96 31.75,60.96 31.75,61.12 32.23,61.59 32.23,66.83 J17.1 | v40.96,38.42 40.32,39.05 v40.32,40.32 | v43.02,45.72 v45.24,47.94 | 29.53,28.89 v28.57,27.94 | 29.53,28.89 32.07,28.89 32.07,26.35 JP5.5 | v29.37,30.8 29.53,30.64 29.53,28.89 | v17.46,50.8 v21.59,46.67 21.59,37.31 C10.2 | 28.42,62.39 23.81,57.79 23.81,56.99 v21.43,54.61 | J19.1 58.26,11.59 58.26,18.89 J18.1 | v47.31,30 44.77,27.46 v44.77,21.59 44.77,15.08 43.81,15.08 35.08,23.81 35.08,24.13 JP5.3 | v28.26,11.11 28.42,11.27 28.42,15.4 S1.3
LED1  (via drill 0.33)
  Top 0.203: v29.53,58.26 36.19,58.26 43.97,66.04 46.35,66.04 48.58,63.82 48.58,56.83 51.91,53.5 51.91,47.94 MDBT1.8 | v28.1,56.83 26.67,56.83 23.18,53.34 R2.1
  Bottom 0.203: v28.1,56.83 v29.53,58.26
LED2  (via drill 0.33)
  Top 0.203: v23.02,61.75 30.48,69.22 55.88,69.22 57.63,67.47 57.63,53.82 55.25,51.44 55.25,47.94 MDBT1.3 | v23.02,57.15 23.02,55.88 R5.1
  Bottom 0.203: v23.02,57.15 v23.02,61.75
MISO  (via drill 0.33)
  Top 0.203: v46.35,35.08 47.15,35.08 49.53,37.47 49.53,38.42 MDBT1.39 | v43.34,35.08 42.23,35.08 38.58,38.73 v36.04,38.73 | v31.43,61.75 v33.97,59.21
  Bottom 0.203: v43.34,35.08 v46.35,35.08 | v36.04,38.73 35.24,39.53 35.24,57.94 v33.97,59.21 | v31.43,61.75 26.67,66.52 26.67,67.31 J15.2
MOSI  (via drill 0.33)
  Top 0.203: v48.74,37.62 48.74,38.42 MDBT1.37 | v43.02,51.12 42.7,51.12 39.69,54.13 31.75,54.13 v25.4,60.48
  Bottom 0.203: v48.74,37.62 48.74,44.77 46.04,47.47 46.04,48.1 v43.02,51.12 | v25.4,60.48 21.59,64.29 J15.1
N$1
  Top 0.203: D7.A R2.2
N$2
  Top 0.203: R3.1 15.56,62.07 13.97,60.48 13.97,60.33 13.33,59.69 13.02,59.69 11.91,60.8 11.91,65.72 J13.3
N$3
  Top 0.203: R4.1 18.26,62.23 18.26,63.34 14.76,66.83 12.86,66.83 12.7,66.67 12.7,65.88 J13.2
N$5  (via drill 0.33)
  Top 0.203: 21.43,41.59 21.43,44.77 D3.C 21.59,44.93 24.61,44.93 D1.C | 21.43,41.59 D4.C 21.43,41.59 | 3V_REGULATOR.3 34.13,34.92 31.59,32.38 31.27,32.38 C4.2 31.11,32.38 31.11,33.34 30.48,33.97 30.48,36.2 27.94,38.73 v26.67,38.73 | 21.43,41.59 24.61,41.59 D2.C
  Bottom 0.203: v26.67,38.73 24.76,40.64 24.76,41.43 D2.C
N$6
  Top 0.254: MDBT1.18 44.59,45.58 41.91,48.26 39.44,48.26 Y2.P$2 39.46,48.24 C9.1
N$7
  Top 0.254: MDBT1.17 45.97,46.6 45.73,46.6 45.72,46.61 44.83,46.61 40.71,50.73 Y2.P$1 39.2,50.9 C6.1
N$14
  Top 0.203: D8.A R5.2
N$30
  Top 0.203: D5.A R18.2
N$31
  Top 0.203: D6.A 21.11,50.8 R19.2
NEOPIX  (via drill 0.33)
  Top 0.203: v49.53,40.32 49.21,40.01 49.21,39.53 MDBT1.38 | v47.94,32.7 47.62,32.7 46.67,31.75 39.53,31.75 38.73,32.54 v34.77,32.54 | v24.45,32.86 20.16,32.86 v15.4,37.62
  Bottom 0.203: v49.53,40.32 49.53,34.92 47.94,33.34 v47.94,32.7 | v34.77,32.54 24.45,32.54 v24.45,32.86 | v15.4,37.62 4.92,48.1 4.92,57.31 J16.1
NFC1  (via drill 0.33)
  Top 0.203: v55.56,40.32 55.56,39.53 MDBT1.52 | v54.77,28.42 53.34,28.42 51.59,26.67 48.74,26.67 45.88,23.81 43.18,23.81 41.91,22.54 C7.2 41.91,22.38 36.67,17.14 28.26,17.14 27.15,16.03 27.15,15.08 29.05,13.18 29.05,10.95 27.94,9.84 27.94,2.54 J12.2
  Bottom 0.203: v55.56,40.32 54.45,39.21 54.45,33.34 55.09,32.7 55.09,28.73 v54.77,28.42
P0.29
  Top 0.203: J7.5 47.47,63.02 47.47,57.31 51.12,53.66 51.12,47.94 MDBT1.10
P1.01  (via drill 0.33)
  Top 0.203: v53.66,41.28 52.86,41.28 MDBT1.61
  Bottom 0.203: v53.66,41.28 54.45,42.07 54.45,45.72 53.97,46.2 53.97,52.71 53.34,53.34 J20.1
P1.03  (via drill 0.33)
  Top 0.203: v51.91,42.07 52.7,42.07 MDBT1.60
  Bottom 0.203: v51.91,42.07 52.7,42.86 52.7,52.07 52.07,52.71 52.07,55.88 J20.2
P1.04  (via drill 0.33)
  Top 0.203: v51.91,45.24 52.7,45.24 MDBT1.56 | v49.37,67.63 53.02,67.63 J20.6
  Bottom 0.203: v51.91,45.24 51.91,44.61 51.28,43.97 49.69,43.97 49.69,44.93 49.37,45.24 v49.37,67.63
P1.05  (via drill 0.33)
  Top 0.203: v53.66,42.86 52.86,42.86 MDBT1.59 | v53.18,52.55 53.18,52.86 52.07,53.98 52.07,58.42 J20.3
  Bottom 0.203: v53.66,42.86 53.18,43.34 v53.18,52.55
P1.06  (via drill 0.33)
  Top 0.203: v55.25,44.45 52.86,44.45 MDBT1.57
  Bottom 0.203: v55.25,44.45 57.15,46.36 57.15,62.87 56.51,63.5 53.34,63.5 J20.5
P1.07  (via drill 0.33)
  Top 0.203: v51.12,44.77 52.23,43.66 52.7,43.66 MDBT1.58
  Bottom 0.203: v51.12,44.77 51.12,60.01 J20.4
P1.11
  Top 0.203: J21.4 54.61,60.96 54.61,53.98 55.09,53.5 55.09,52.86 53.66,51.44 53.66,47.94 MDBT1.4
P1.12
  Top 0.203: J21.3 57.15,58.42 57.15,53.98 54.61,51.44 54.61,47.78 53.82,46.99 53.34,46.99 MDBT1.5
P1.13  (via drill 0.33)
  Top 0.203: v54.29,53.34 54.29,52.71 52.86,51.28 52.86,47.94 MDBT1.6
  Bottom 0.203: v54.29,53.34 54.61,53.66 54.61,55.88 J21.2
P1.14  (via drill 0.33)
  Top 0.203: v54.93,46.2 52.86,46.2 52.55,46.51 52.55,46.83 MDBT1.7
  Bottom 0.203: v54.93,46.2 55.88,47.15 J21.1
QSPI_CS  (via drill 0.33)
  Top 0.203: v51.12,33.34 51.91,34.13 51.91,38.42 MDBT1.44 | v52.39,28.42 51.28,28.42 51.12,28.57 U$4.1
  Bottom 0.203: v51.12,33.34 50.8,33.02 50.8,27.46 51.44,26.83 52.39,26.83 v52.39,28.42
QSPI_DATA0
  Top 0.203: U$4.5 46.35,32.38 50.32,36.35 50.32,38.42 MDBT1.41
QSPI_DATA1
  Top 0.203: U$4.2 52.07,29.84 53.18,30.96 53.18,31.27 52.86,31.59 52.86,38.42 MDBT1.46
QSPI_DATA2  (via drill 0.33)
  Top 0.203: v52.39,40.32 52.39,39.53 MDBT1.45 | U$4.3 v52.39,31.11
  Bottom 0.203: v52.39,31.11 v52.39,40.32
QSPI_DATA3
  Top 0.203: MDBT1.43 51.44,39.37 51.44,34.92 47.31,30.8 46.51,30.8 45.56,29.84 U$4.7
QSPI_SCK  (via drill 0.33)
  Top 0.203: v49.37,33.81 50.96,35.4 50.96,38.89 50.8,39.05 50.8,39.37 MDBT1.42 | v44.29,30.8 45.08,30.8 45.4,31.11 U$4.6
  Bottom 0.203: v49.37,33.81 49.69,33.5 49.69,30.48 49.05,29.84 48.1,29.84 48.1,30.16 47.47,30.8 v44.29,30.8
RESET  (via drill 0.33)
  Top 0.203: R1.1 34.92,21.91 32.07,21.91 30.32,20.16 28.57,20.16 S1.1 | X2.10 20.95,27.94 21.75,28.73 29.05,28.73 JP5.10 | v50.48,40.32 50.01,39.85 50.01,39.53 MDBT1.40
  Bottom 0.203: JP5.10 28.57,26.67 28.57,20.16 S1.1 28.57,20 33.18,15.4 33.18,5.4 37.47,1.11 48.1,1.11 48.1,2.54 J6.2 48.26,2.54 50.16,4.45 50.16,40.01 v50.48,40.32
RX  (via drill 0.33)
  Top 0.203: v57.63,28.26 53.5,32.38 53.5,38.42 MDBT1.48 | v56.83,24.29 54.61,24.29 46.2,15.88 v43.97,15.88 | v23.65,32.07 20,32.07 v14.45,37.62
  Bottom 0.203: v57.63,28.26 57.63,25.08 v56.83,24.29 | v43.97,15.88 32.54,27.3 32.54,29.05 29.53,32.07 v23.65,32.07 | v14.45,37.62 4.44,47.62 4.44,52.55 2.54,54.45 J14.2
SCK  (via drill 0.33)
  Top 0.203: v47.78,40.16 47.78,40.01 48.26,39.53 MDBT1.36 | v46.35,33.34 v47.94,34.92 | v43.34,33.97 41.28,33.97 37.47,37.78 v36.04,37.78 | v28.73,46.83 28.42,46.83 26.67,48.58 v24.13,48.58
  Bottom 0.203: v47.78,40.16 47.94,40.01 v47.94,34.92 | v46.35,33.34 43.34,33.34 v43.34,33.97 | v36.04,37.78 28.73,45.09 v28.73,46.83 | v24.13,48.58 19.68,53.02 19.68,58.26 13.33,64.61 2.54,64.61 J16.2
SCL  (via drill 0.33)
  Top 0.203: v47.94,41.91 47.15,41.91 MDBT1.27 | v46.35,36.04 43.5,33.18 35.08,33.18 34.92,33.34 33.66,33.34 30.32,30 8.41,30 2.54,24.13 J10.2
  Bottom 0.203: v47.94,41.91 46.35,40.32 v46.35,36.04
SDA  (via drill 0.33)
  Top 0.203: v50.96,41.12 47.15,41.12 MDBT1.29 | v51.59,27.62 40.48,27.62 35.56,22.7 32.23,22.7 30.96,21.43 19.53,21.43 18.57,20.48 3.97,20.48 J10.1
  Bottom 0.203: v50.96,41.12 51.59,40.48 51.59,33.81 51.91,33.5 51.91,31.59 51.59,31.27 v51.59,27.62
SWCLK  (via drill 0.33)
  Top 0.203: v56.04,35.56 56.04,38.42 MDBT1.53 | v56.36,14.45 51.91,14.45 38.58,1.11 34.45,1.11 J5.1 | v27.78,24.13 JP5.4 | X2.4 20.95,24.13 21.43,24.61 v21.75,24.61
  Bottom 0.203: v56.04,35.56 56.04,14.76 v56.36,14.45 | J5.1 27.15,8.41 27.15,23.49 v27.78,24.13 27.78,24.61 v21.75,24.61
SWDIO  (via drill 0.33)
  Top 0.203: v54.29,32.54 56.04,34.29 56.04,34.61 55.25,35.4 55.25,38.42 MDBT1.51 | v53.97,24.61 51.75,24.61 38.1,10.95 38.1,2.54 J5.2 | X2.2 20.95,22.86 v21.43,22.38 | v26.35,23.02 29.69,23.02 JP5.2
  Bottom 0.203: v54.29,32.54 53.97,32.23 v53.97,24.61 | JP5.2 30.64,22.07 30.64,18.57 33.66,15.56 33.66,6.83 37.94,2.54 J5.2 | v21.43,22.38 26.35,22.38 v26.35,23.02
SWO  (via drill 0.33)
  Top 0.203: v53.34,40.32 53.34,39.53 MDBT1.47 | v53.18,12.54 J6.1 41.28,0.64 32.38,0.64 v31.43,1.59 | X2.6 18.57,25.4 17.78,24.61 17.78,21.91 v18.41,21.27
  Bottom 0.203: v53.34,40.32 53.18,40.16 v53.18,12.54 | v18.41,21.27 26.67,13.02 26.67,6.35 v31.43,1.59
TX  (via drill 0.33)
  Top 0.203: v55.25,34.45 54.13,35.56 54.13,39.37 MDBT1.49
  Bottom 0.203: v55.25,34.45 55.56,34.13 55.56,7.94 48.26,0.64 3.97,0.64 3.97,47.94 2.54,49.37 J14.1
USBD+  (via drill 0.33)
  Top 0.203: v39.69,38.73 41.59,36.83 46.51,36.83 47.94,38.26 47.94,38.42 MDBT1.35 | v36.04,57.15 29.69,57.15 27.78,59.05 | 27.78,59.05 25.56,61.28 24.13,61.28 20.16,57.31 18.57,57.31 15.72,60.17 R3.2 | J21.5 55.25,64.77 53.97,66.04 48.89,66.04 46.35,68.58 40,68.58 33.97,62.55 31.27,62.55 27.78,59.05
  Bottom 0.203: v39.69,38.73 37.62,40.8 37.62,55.56 v36.04,57.15
USBD-  (via drill 0.33)
  Top 0.203: v45.56,37.62 46.51,37.62 46.83,37.94 46.83,38.1 47.15,38.42 MDBT1.34 | v44.13,67.15 v42.23,65.25 | v24.92,66.83 18.41,60.33 R4.2
  Bottom 0.203: v45.56,37.62 45.4,37.78 45.4,43.02 43.81,44.61 42.23,44.61 v42.23,65.25 | v44.13,67.15 44.45,67.47 44.45,67.95 45.24,68.74 | 45.24,68.74 45.4,68.9 55.56,68.9 55.56,67.63 J21.6 | v24.92,66.83 25.24,67.15 25.24,67.95 26.03,68.74 45.24,68.74
V_USB  (via drill 0.33)
  Top 0.203: v47.15,39.53 46.83,39.21 46.2,39.21 MDBT1.32 | J18.2 59.69,25.24 55.72,29.21 50.32,29.21 v48.89,30.64 47.47,29.21 40.64,29.21 39.37,30.48 31.43,30.48 30.16,29.21 9.68,29.21 1.11,20.64 | v13.18,60.48 13.18,65.72 J13.1 | D4.A 16.99,41.43 14.6,41.43 D2.A 14.45,41.43 2.06,41.43 1.11,40.48 1.11,20.64 | J2.1 2.54,10.79 1.11,12.22 1.11,20.64
  Bottom 0.203: v47.15,39.53 47.15,32.38 v48.89,30.64 | v13.18,60.48 13.18,42.86 14.45,41.59 D2.A

### Text on the board
tPlace: P1.04 | A5 | USB- | P1.06 | SCK | P0.29 | USB+ | P1.07 | P1.11 | A4 | P1.12 | NEOPIX | P1.05 | MOSI | MISO | GND | VIN | AREF | P1.03 | P1.13 | A3 | LED2 | P1.01 | P1.14 | RX | A2 | LED1 | 10pF | TX | D13 | 3.3V | 10pF | 32.768 | D10 | 3.3V Reg | D9 | A0 | 100nF | nRF5280 / MDBT50Q-P1M | A1 | VUSB | SCL | GND | SDA | 3.3V | 12V | GND | VUSB | D5 | D11 | D2/NFC2 | NFC1 | SWCLK | SWDIO | SWO | RESET | 3V | GND
bPlace: Test Layout for nRf52840 / MDBT50Q-P1M - Module / Thomas Hudson / 02/25/19